# EAGLE design DomoMod (EAGLE 6.5.0)
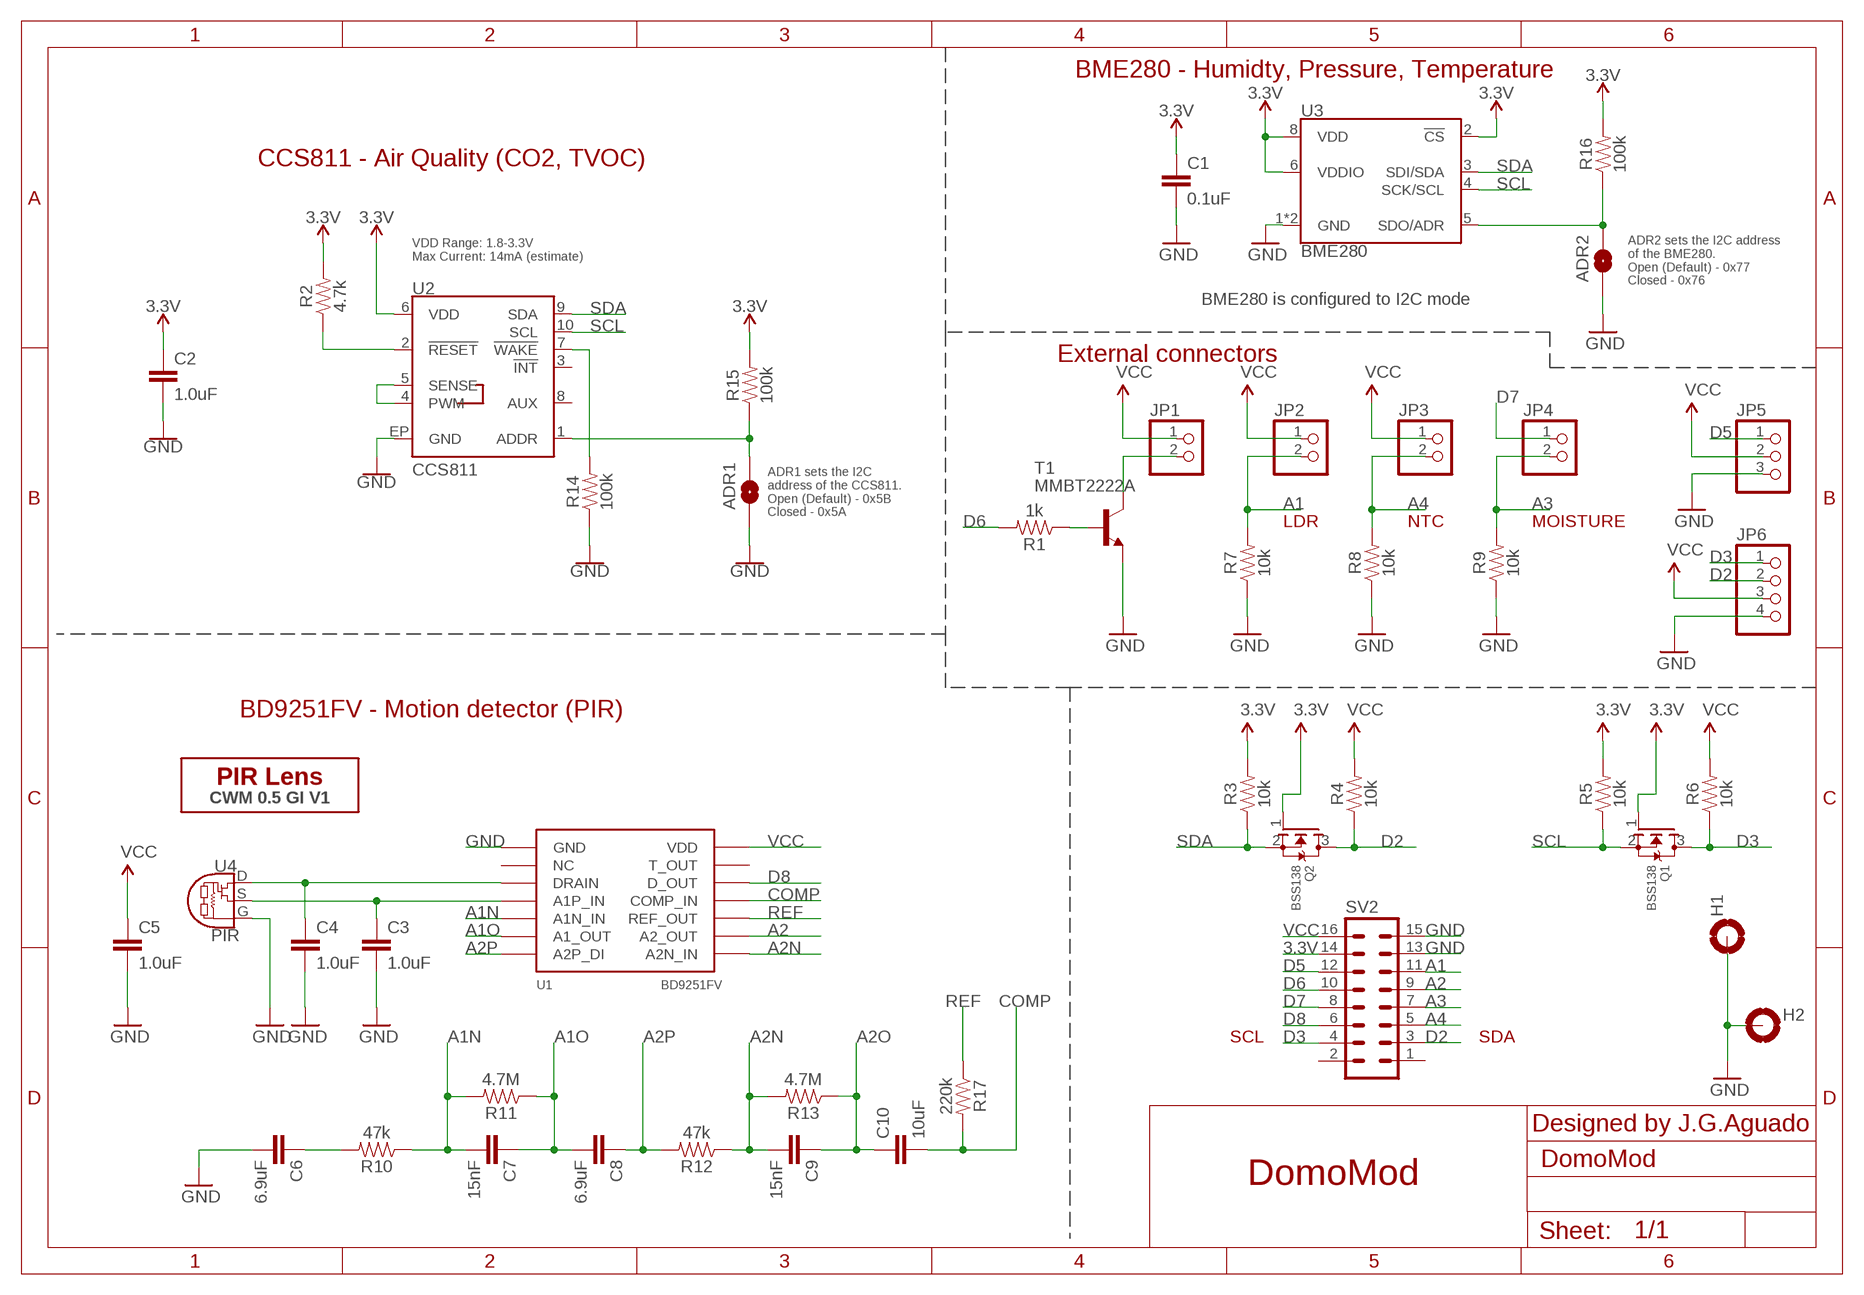
[diagram p0: schematic, sheet 1]

## Parts
ADR1  JUMPER-SMT_2_NO_SILK  [SMT-JUMPER_2_NO_SILK]
ADR2  JUMPER-SMT_2_NO_SILK  [SMT-JUMPER_2_NO_SILK]
C1  0.1uF  0.1UF-0603-25V-(+80/-20%)  [0603]
C2  1.0uF  1.0UF-0603-16V-10%  [0603]
C3  1.0uF  1.0UF-0603-16V-10%  [0603]
C4  1.0uF  1.0UF-0603-16V-10%  [0603]
C5  1.0uF  1.0UF-0603-16V-10%  [0603]
C6  6.9uF  1.0UF-0603-16V-10%  [0603]
C7  15nF  1.0UF-0603-16V-10%  [0603]
C8  6.9uF  1.0UF-0603-16V-10%  [0603]
C9  15nF  1.0UF-0603-16V-10%  [0603]
C10  10uF  1.0UF-0603-16V-10%  [0603]
H1  MOUNT-PAD-ROUND3.2  [3,2-PAD]
H2  MOUNT-PAD-ROUND3.2  [3,2-PAD]
JP1  PINHD-1X2  [1X02]
JP2  PINHD-1X2  [1X02]
JP3  PINHD-1X2  [1X02]
JP4  PINHD-1X2  [1X02]
JP5  PINHD-1X3  [1X03]
JP6  PINHD-1X4  [1X04]
Q1  BSS138  MOSFET-NREFLOW  [SOT23]
Q2  BSS138  MOSFET-NREFLOW  [SOT23]
R1  1k  100KOHM-0603-1/10W-1%  [0603]
R2  4.7k  4.7KOHM-0603-1/10W-1%  [0603]
R3  10k  100KOHM-0603-1/10W-1%  [0603]
R4  10k  100KOHM-0603-1/10W-1%  [0603]
R5  10k  100KOHM-0603-1/10W-1%  [0603]
R6  10k  100KOHM-0603-1/10W-1%  [0603]
R7  10k  100KOHM-0603-1/10W-1%  [0603]
R8  10k  100KOHM-0603-1/10W-1%  [0603]
R9  10k  100KOHM-0603-1/10W-1%  [0603]
R10  47k  100KOHM-0603-1/10W-1%  [0603]
R11  4.7M  100KOHM-0603-1/10W-1%  [0603]
R12  47k  100KOHM-0603-1/10W-1%  [0603]
R13  4.7M  100KOHM-0603-1/10W-1%  [0603]
R14  100k  100KOHM-0603-1/10W-1%  [0603]
R15  100k  100KOHM-0603-1/10W-1%  [0603]
R16  100k  100KOHM-0603-1/10W-1%  [0603]
R17  220k  100KOHM-0603-1/10W-1%  [0603]
SV2  MA08-2  [MA08-2]
T1  MMBT2222A  BC808-NPN-SOT23-BEC  [SOT23-BEC]
U1  BD9251FV  [TSSOP-14]
U2  CCS811  CCS811PRODUCTION  [LGA10]
U3  BME280  [LGA-8-2.5X2.5]
U4  PIR  [PIR]
U$1  CWM 0.5 GI V1  PIR-LENSCWM-0.5-GI-V1  [LENS-CWM-0.5-GI-V1]

## Nets
3.3V: C1.1 C2.1 Q1.1(G) Q2.1(G) R2.2 R3.2 R5.2 R15.2 R16.2 SV2.14 U2.6(VDD) U3.2(!CS) U3.6(VDDIO) U3.8(VDD)
!RST: R2.1 U2.2(!RESET!)
!WAKE: R14.2 U2.7(!WAKE!)
A1: JP2.2 R7.2 SV2.11
A1N: C7.2 R10.1 R11.2 U1.5(A1N_IN)
A1O: C7.1 C8.2 R11.1 U1.6(A1_OUT)
A2: SV2.9 U1.9(A2_OUT)
A2N: C9.2 R12.1 R13.2 U1.8(A2N_IN)
A2O: C9.1 C10.1 R13.1
A2P: C8.1 R12.2 U1.7(A2P_DI)
A3: JP4.2 R9.2 SV2.7
A4: JP3.2 R8.2 SV2.5
CCS811_ADDR: ADR1.2 R15.1 U2.1(ADDR)
COMP: C10.2 R17.2 U1.11(COMP_IN)
D2: JP6.2 Q2.3(D) R4.1 SV2.3
D3: JP6.1 Q1.3(D) R6.1 SV2.4
D5: JP5.1 SV2.12
D6: R1.2 SV2.10
D7: JP4.1 SV2.8
D8: SV2.6 U1.12(D_OUT)
GND: ADR1.1 ADR2.1 C1.2 C2.2 C3.2 C4.2 C5.2 C6.2 H1.B3,2(MOUNT) H2.B3,2(MOUNT) JP5.3 JP6.4 R7.1 R8.1 R9.1 R14.1 SV2.13 SV2.15 T1.E U1.1(GND) U2.EP(GND) U3.1(GND) U3.7(GND) U4.G
N$1: C6.1 R10.2
N$2: C3.1 U1.4(A1P_IN) U4.S
N$5: C4.1 U1.3(DRAIN) U4.D
N$9: JP1.2 T1.C
N$10: R1.1 T1.B
NTC_SENSE: U2.4(PWM) U2.5(SENSE)
REF: R17.1 U1.10(REF_OUT)
SCL: Q1.2(S) R5.1 U2.10(SCL) U3.4(SCK/SCL)
SDA: Q2.2(S) R3.1 U2.9(SDA) U3.3(SDI/SDA)
SDO/ADR: ADR2.2 R16.1 U3.5(SDO/ADR)
VCC: C5.1 JP1.1 JP2.1 JP3.1 JP5.2 JP6.3 R4.2 R6.2 SV2.16 U1.14(VDD)
Unconnected: SV2.1 SV2.2 U1.2(NC) U1.13(T_OUT) U2.3(!INT!) U2.8(AUX)

## Notes on the sheet
- BME280 - Humidty, Pressure, Temperature
- CCS811 - Air Quality (CO2, TVOC)
- ADR2 sets the I2C address
  of the BME280.
  Open (Default) - 0x77
  Closed - 0x76
- VDD Range: 1.8-3.3V
  Max Current: 14mA (estimate)
- BME280 is configured to I2C mode
- External connectors
- Humidity
- ADR1 sets the I2C 
  address of the CCS811.
  Open (Default) - 0x5B
  Closed - 0x5A
- LDR | NTC | MOISTURE
- BD9251FV - Motion detector (PIR) | Pressure
- SCL | SDA
- Designed by J.G.Aguado
- DomoMod

## Library data of the parts
ADR1 ADR2 = SparkFun-Jumpers:JUMPER-SMT_2_NO: Normally open jumper This jumper has two pads in close proximity to each other. Apply solder to close the connection. Round pads are easier to solder for beginners, but are a lot larger. SparkFun Product that uses the round pads: SparkFun EL Sequencer <https://www.sparkfun.com/products/12781>
C1 = SparkFun-Capacitors:0.1UF: 0.1µF ceramic capacitors A capacitor is a passive two-terminal electrical component used to store electrical energy temporarily in an electric field.; PROD_ID: CAP-00810
C2-C5 = SparkFun-Capacitors:1.0UF: 1µF ceramic capacitors A capacitor is a passive two-terminal electrical component used to store electrical energy temporarily in an electric field.; PROD_ID: CAP-00868
C6-C10 = SparkFun-Capacitors:1.0UF: 1µF ceramic capacitors A capacitor is a passive two-terminal electrical component used to store electrical energy temporarily in an electric field.; PROD_ID: CAP-00868; VALUE: 1.0uF
H1 H2 = holes:MOUNT-PAD-ROUND: MOUNTING PAD, round
JP1-JP4 = pinhead:PINHD-1X2: PIN HEADER
JP5 = pinhead:PINHD-1X3: PIN HEADER
JP6 = pinhead:PINHD-1X4: PIN HEADER
Q1 Q2 = adafruit:MOSFET-N: N-Channel Mosfet 2N7002E - 60V 260mA SOT23 [Digikey: 2N7002ET1GOSTR-ND] - REEL BSH103 - 30V 850mA SOT23 [Digikey: 568-5013-1-ND]
R1 R3-R13 R17 = SparkFun-Resistors:100KOHM: 100kΩ resistor A resistor is a passive two-terminal electrical component that implements electrical resistance as a circuit element. Resistors act to reduce current flow, and, at the same time, act to lower voltage levels within circuits. - Wikipedia; PROD_ID: RES-07828; VALUE: 100k
R2 = SparkFun-Resistors:4.7KOHM: 4.7kΩ resistor A resistor is a passive two-terminal electrical component that implements electrical resistance as a circuit element. Resistors act to reduce current flow, and, at the same time, act to lower voltage levels within circuits. - Wikipedia; PROD_ID: RES-07857
R14-R16 = SparkFun-Resistors:100KOHM: 100kΩ resistor A resistor is a passive two-terminal electrical component that implements electrical resistance as a circuit element. Resistors act to reduce current flow, and, at the same time, act to lower voltage levels within circuits. - Wikipedia; PROD_ID: RES-07828
SV2 = con-lstb:MA08-2: PIN HEADER; OC_FARNELL: unknown; OC_NEWARK: unknown
T1 = transistor:*-NPN-: NPN Transistror BF959 corrected 2008.03.06
U1 = SpaceDIY_IC:BD9251FV: Amplifier for Pyroelectric Infrared Sensor
U2 = SparkFun-Sensors:CCS811: AMS CCS811 – I2C Digital Gas Sensor Ultra-Low Power Digital Gas Sensor for Monitoring Indoor Air Quality AMS Product Page <http://ams.com/eng/Products/Environmental-Sensors/Gas-Sensors/CCS811> SparkFun Products:; PROD_ID: IC-13607
U3 = SparkFun-Sensors:BME280: Bosch BME280 – Combined Humidity and Pressure Sensor The BME280 is as combined digital humidity, pressure and temperature sensor based on proven sensing principles. The sensor module is housed in an extremely compact metal-lid LGA package with a footprint of only 2.5×2.5mm² with a height of 0.93mm. Its small dimensions and its low power consumption allow the implementation in battery driven devices such as handsets, GPS modules or watches. Datasheet <https://cdn.sparkfun.com/assets/learn_tutorials/4/1/9/BST-BME280_DS001-10.pdf> SparkFun Products SparkFun Atmospheric Sensor Breakout - BME280 <https://www.sparkfun.com/products/13676> (SEN-13676); PROD_ID: IC-13090
U4 = openPIR-temp:PIR; PROD_ID: IC-13430
U$1 = openPIR-temp:PIR-LENS

## Net classes
1 vcc: width 0.254 mm

## Board
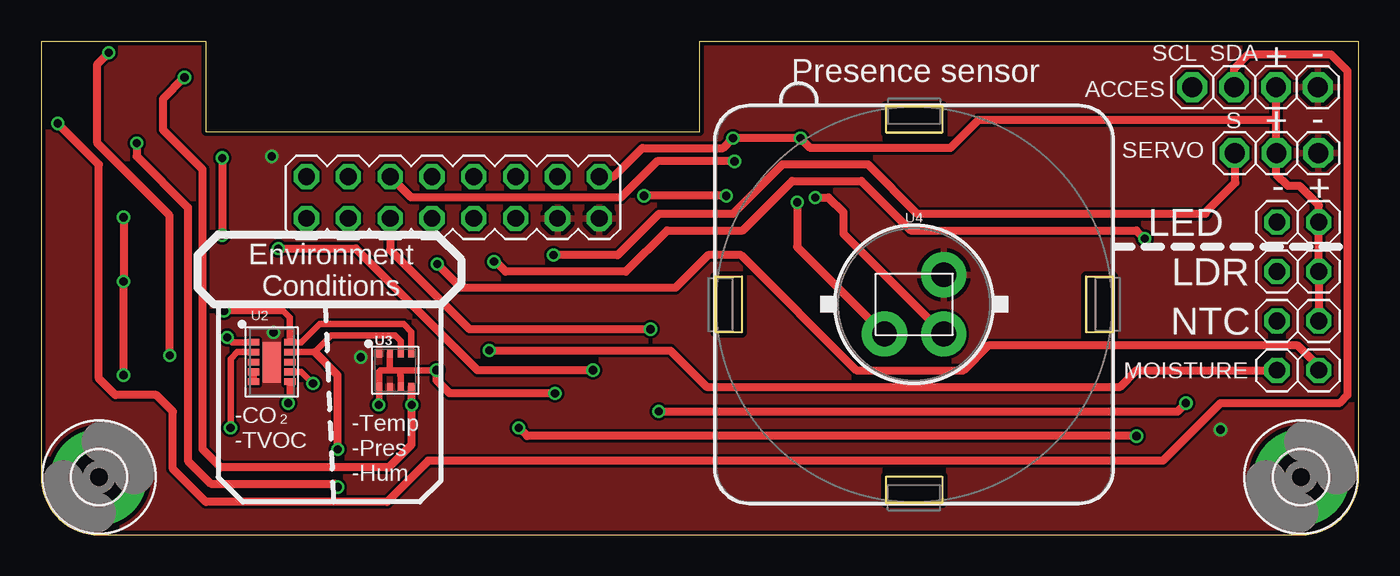
[diagram p1: board, top side]
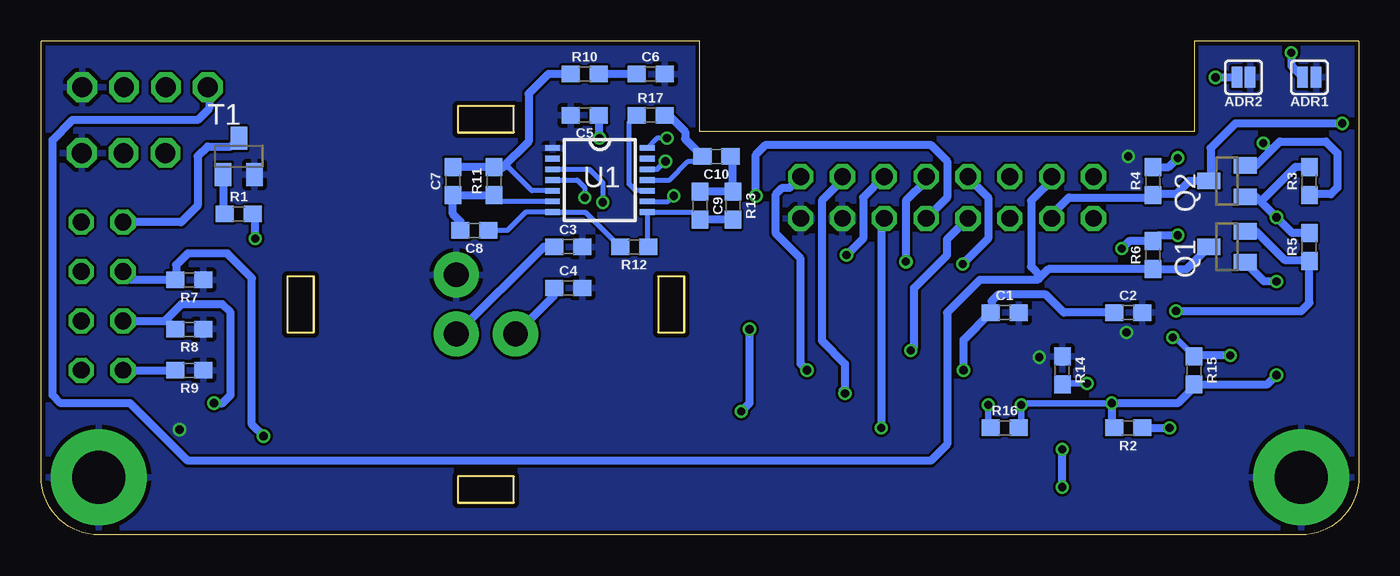
[diagram p2: board, bottom side, seen from below]

Size 80 x 30 mm. Coordinates in mm from the lower left corner, seen from the top.
Outline: 0,30 0,3.5 arc90 3.5,0 76.5,0 arc90 80,3.5 80,30 40,30 40,24.5 10,24.5 10,30 0,30
Copper layers (1*16): Top 0.035mm / dielectric 1.5mm / Bottom 0.035mm
Design rules "SeeedStudio_2layer_DRU_no_angle_20140221": minimum track width 6mil, minimum drill 12mil, track to track 6mil, track to pad 6mil, pad to pad 6mil, via to via 6mil, smd to smd 0mil, copper to edge 10mil, drill to drill 10mil, minimum pad ring 10mil, minimum via ring 6mil, stop-mask expansion 2mil, vias tented up to drill 100mil, thermal gap 10mil

### Footprints (pad centres in the part's own frame; a part is rotated, then mirrored left to right if it is on the bottom)
SMT-JUMPER_2_NO_SILK = smd 0.635 x 1.27: 1 -0.406,0; 2 0.406,0
0603 = smd 1.1 x 1: 1 -0.85,0; 2 0.85,0
3,2-PAD = drill 3.2 pad 5.842: B3,2 0,0
1X02 = drill 1.016 octagon: 1 -1.27,0; 2 1.27,0
1X03 = drill 1.2 octagon: 1 -2.54,0; 2 0,0; 3 2.54,0
1X04 = drill 1.2 octagon: 1 -3.81,0; 2 -1.27,0; 3 1.27,0; 4 3.81,0
SOT23 = smd 1 x 1.4: 1 -0.95,-1.1; 2 0.95,-1.1; 3 0,1.1
MA08-2 = drill 1.016 octagon: 1 -8.89,-1.27; 2 -8.89,1.27; 3 -6.35,-1.27; 4 -6.35,1.27; 5 -3.81,-1.27; 6 -3.81,1.27; 7 -1.27,-1.27; 8 -1.27,1.27; 9 1.27,-1.27; 10 1.27,1.27; 11 3.81,-1.27; 12 3.81,1.27; 13 6.35,-1.27; 14 6.35,1.27; 15 8.89,-1.27; 16 8.89,1.27
SOT23-BEC = smd 1 x 1.4: B -0.95,-1.1; C 0,1.1; E 0.95,-1.1
TSSOP-14 = smd 0.9 x 0.35: 1 -2.955,2.01; 2 -2.955,1.36; 3 -2.955,0.71; 4 -2.955,0.06; 5 -2.955,-0.59; 6 -2.955,-1.24; 7 -2.955,-1.89; 8 2.795,-1.89; 9 2.795,-1.24; 10 2.795,-0.59; 11 2.795,0.06; 12 2.795,0.71; 13 2.795,1.36; 14 2.795,2.01
LGA10 = smd 0.7 x 0.4: 1 -1.1,1.2; 2 -1.1,0.6; 3 -1.1,0; 4 -1.1,-0.6; 5 -1.1,-1.2; 6 1.1,-1.2; 7 1.1,-0.6; 8 1.1,0; 9 1.1,0.6; 10 1.1,1.2 | smd 1.1 x 2.45: EP 0,0
LGA-8-2.5X2.5 = smd 0.35 x 0.5: 1 -0.975,1.025; 2 -0.325,1.025; 3 0.325,1.025; 4 0.975,1.025; 5 0.975,-1.025; 6 0.325,-1.025; 7 -0.325,-1.025; 8 -0.975,-1.025
PIR = drill 1.5 pad 2.75: D -1.8,-1.8; G 1.8,1.8; S 1.8,-1.8

### Placement (x,y rotation side)
ADR1  3,27.8 180 bottom
ADR2  7,27.8 180 bottom
C1  21.5,13.5 0 bottom
C2  14,13.5 0 bottom
C3  48,17.5 0 bottom
C4  48,15 0 bottom
C5  47,25.5 180 bottom
C6  43,28 0 bottom
C7  55,21.5 90 bottom
C8  53.7,18.5 180 bottom
C9  40,20 270 bottom
C10  39,23 180 bottom
H1  3.5,3.5 0 top
H2  76.5,3.5 0 top
JP1  76.3,19 180 top
JP2  76.3,16 180 top
JP3  76.3,13 180 top
JP4  76.3,10 180 top
JP5  75,23.2 0 top
JP6  73.7,27.2 0 top
Q1  8,17.5 90 bottom
Q2  8,21.5 90 bottom
R1  68,19.5 0 bottom
R2  14,6.5 180 bottom
R3  3,21.5 90 bottom
R4  12.5,21.5 90 bottom
R5  3,17.5 90 bottom
R6  12.5,17 90 bottom
R7  71,15.5 180 bottom
R8  71,12.5 180 bottom
R9  71,10 180 bottom
R10  47,28 0 bottom
R11  52.5,21.5 90 bottom
R12  44,17.5 180 bottom
R13  38,20 270 bottom
R14  18,10 270 bottom
R15  10,10 270 bottom
R16  21.5,6.5 0 bottom
R17  43,25.5 0 bottom
SV2  25,20.5 0 top
T1  68,23 0 bottom
U1  46,21.5 0 bottom
U2  14,10.5 0 top
U3  21.5,10 0 top
U4  53,14 0 top
U$1  53,14 0 top

### Tracks (layer width: path | path; a pad name or v marks a point on that pad's centre or on a via)
3.3V  (via drill 0.5)
  Top 0.4: U2.6 15.1,8.1 v15,8 | U3.2 21.18,10.07 | 21.18,10.07 21.1,10 | 21.1,10 20.6,10 20.52,9.93 U3.8 20.52,7.92 v20.5,7.9 | U3.6 21.82,9.68 21.8,9.7 21.8,9.9 21.7,10 21.25,10 21.18,10.07 | v24,10 21.1,10
  Top 0.5: v5,19.3 v5,15.4 v5,9.7 | v24,10 24,9.4 24.8,8.6 v31.2,8.6
  Bottom 0.4: R16.2 20.5,6.65 v20.5,7.9 20.4,8 v15,8
  Bottom 0.5: v24,10 24,11.85 C1.1 22.3,13.55 22.3,14.2 21.9,14.6 19,14.6 17.9,13.5 C2.1 | R2.2 15,6.65 v15,8 11,8 10,9 R15.2 5.55,9.15 v5,9.7 | Q2.1 6.25,20.55 5.95,20.25 | 5.95,20.25 v5,19.3 4.05,18.35 R5.2 | v5,15.4 5.75,15.4 Q1.1 | R3.2 3.85,22.35 5.95,20.25 | 31.35,8.75 v31.2,8.6 31.2,10.4 32.6,11.8 32.6,20.3 31.35,21.55 SV2.14
!RST  (via drill 0.5)
  Top 0.4: U2.2 11.9,11.1 11.5,10.7 v11.5,6.5
  Bottom 0.5: R2.1 v11.5,6.5
!WAKE  (via drill 0.5)
  Top 0.4: U2.7 15.8,9.9 v16.5,9.2
  Bottom 0.4: v16.5,9.2 17.95,9.2 R14.2
A1  (via drill 0.5)
  Top 0.5: v66.5,6 29.5,6 v29,6.5
  Bottom 0.5: v29,6.5 29,19.04 SV2.11 | JP2.2 74.53,15.5 R7.2 71.8,15.55 71.8,16.4 71.1,17.1 68.7,17.1 67.2,15.6 67.2,6.7 v66.5,6
A1N
  Bottom 0.3: U1.5 50.21,20.91 51.6,22.3 52,22.3 52.45,22.3 R11.2
  Bottom 0.5: R11.2 C7.2 | R10.1 49.2,28 50.4,26.8 50.4,23.9 52,22.3
A1O
  Bottom 0.3: U1.6 52.11,20.26 R11.1
  Bottom 0.5: C8.2 54.55,19.05 55,19.5 C7.1 R11.1
A2  (via drill 0.5)
  Top 0.5: v41.6,20.6 v36.6,20.6
  Bottom 0.3: U1.9 41.94,20.26 v41.6,20.6
  Bottom 0.5: v36.6,20.6 36.6,23.1 36,23.7 26,23.7 25,22.7 25,20.5 SV2.9
A2N
  Bottom 0.3: C9.2 40.46,19.61 U1.8 43.2,17.55 R12.1
  Bottom 0.5: R13.2 C9.2
A2O
  Bottom 0.5: C10.1 38,22.85 R13.1 C9.1
A2P
  Bottom 0.3: R12.2 46.96,19.61 U1.7 50.59,19.61 51.7,18.5 C8.1
A3  (via drill 0.5)
  Top 0.5: JP4.2 66.5,10 65.5,9 40.4,9 38.2,11.2 v27.2,11.2
  Bottom 0.5: JP4.2 R9.2 | v27.2,11.2 27,11.4 27,15 25,17 25,17.96 SV2.7
A4  (via drill 0.5)
  Top 0.5: v37,12.5 26,12.5 21.19,17.31 SV2.5 | v37.5,7.5 69,7.5 v69.5,8
  Bottom 0.5: JP3.2 72.5,13 | 72.5,13 72.35,13 R8.2 | v37,12.5 37,8 v37.5,7.5 | v69.5,8 69,8 68.5,8.5 68.5,13.5 69,14 71.5,14 72.5,13
CCS811_ADDR  (via drill 0.5)
  Top 0.4: U2.1 11.6,11.7 v11.3,12
  Top 0.5: v7.8,10.9 7.8,19.4 3.41,23.79 3.41,28.61 v4.1,29.3
  Bottom 0.4: v11.3,12 11.15,12 R15.1
  Bottom 0.5: v7.8,10.9 9.95,10.9 R15.1 | v4.1,29.3 4.1,28.49 ADR1.2
COMP
  Bottom 0.3: U1.11 41.84,21.56 40.7,22.7 40.15,22.7 C10.2
  Bottom 0.5: R17.2 41.9,25.5 40.9,24.5 40.9,24.05 C10.2
D2  (via drill 0.5)
  Top 0.5: JP6.2 72.43,28.33 73.3,29.2 78.3,29.2 79.3,28.2 79.3,8.5 78.8,8 71.6,8 68.1,4.5 23.5,4.5 21,2 10,2 8,4 8,7.5 7,8.5 4.5,8.5 3.5,9.5 3.5,22.5 v1,25
  Bottom 0.5: v1,25 7.5,25 9,23.5 9,21.6 Q2.3 10.3,21.5 11.1,20.7 12.45,20.7 R4.1 12.65,20.5 17.6,20.5 18.65,19.45 SV2.3
D3
  Bottom 0.5: Q1.3 10.45,16.15 R6.1 18.85,16.15 19.3,15.7 | JP6.1 69.8,27.11 69.8,25.9 70.5,25.2 78.1,25.2 79.3,24 79.3,8.5 78.8,8 74.6,8 71.1,4.5 26,4.5 25,5.5 25,13.5 23,15.5 19.5,15.5 19.3,15.7 | SV2.4 18.65,21.55 19.9,20.3 19.9,16.3 19.3,15.7
D5  (via drill 0.5)
  Top 0.5: v31.1,17 35,17 37.5,19.5 42,19.5 45,22.5 50.2,22.5 53.2,19.5 70.7,19.5 70.7,19.6 72.5,21.4 72.5,23.16 JP5.1 72.4,23.14
  Bottom 0.5: SV2.12 28.83,21.77 30.1,20.5 30.1,18 v31.1,17
D6  (via drill 0.5)
  Top 0.5: v67,18 66.5,18.5 52.8,18.5 49.8,21.5 45.6,21.5 42.6,18.5 38,18.5 35.5,16 28.2,16 27.6,16.6 v27.5,16.6
  Bottom 0.5: v67,18 67,19.35 R1.2 | SV2.10 26.27,21.53 27.5,20.3 v27.5,16.6
D7  (via drill 0.5)
  Top 0.5: 24,16.5 v24.05,16.45 25.5,15 38.5,15 40.5,17 42.5,17 49.5,10 56,10 57.5,11.5 76.3,11.5 77.57,10.23 JP4.1
  Bottom 0.5: SV2.8 23.73,21.73 22.5,20.5 22.5,18 v24.05,16.45
D8  (via drill 0.5)
  Top 0.5: v42.1,22.7 37.4,22.7 35.2,20.5 22.46,20.5 SV2.6
  Bottom 0.3: U1.12 42.59,22.21 v42.1,22.7
GND  (via drill 0.5)
  other vias: 19.4,10.8 14.1,12.3 14,23 71.6,6.4
  pour Top: 80,30 80,3.5 arc-90 76.5,0 3.5,0 arc-90 0,3.5 0,30 10,30 10,24.5 40,24.5 40,30
  pour Bottom: 80,30 80,3.5 arc-90 76.5,0 3.5,0 arc-90 0,3.5 0,30 10,30 10,24.5 40,24.5 40,30
N$1
  Bottom 0.5: C6.1 R10.2
N$2  (via drill 0.5)
  Top 0.5: v47,20.5 47.8,20.5 48.7,19.6 48.7,18.3 U4.S
  Bottom 0.3: U1.4 47.46,21.56 47,21.1 v47,20.5
  Bottom 0.5: C3.1 49.5,17.5 U4.S
N$5  (via drill 0.5)
  Top 0.5: v45.9,20.2 45.9,17.5 U4.D
  Bottom 0.3: U1.3 46.71,22.21 45.9,21.4 v45.9,20.2
  Bottom 0.5: C4.1 48.85,14.55 U4.D
N$9
  Bottom 0.5: JP1.2 71.5,19 70.5,20 70.5,23 69.9,23.6 68.5,23.6 T1.C
N$10
  Bottom 0.5: T1.B 68.95,19.6 R1.1
NTC_SENSE
  Top 0.4: U2.5 U2.4
REF
  Bottom 0.3: U1.10 43.91,20.91 44.3,21.3 44.3,25.05 R17.1
SCL  (via drill 0.5)
  Top 0.4: U3.4 22.48,12.32 22,12.8 16.9,12.8 15.8,11.7 U2.10 15.1,13.2 14.7,13.6 v11.1,13.6
  Bottom 0.5: v11.1,13.6 3.5,13.6 3,14.1 R5.1 3.05,16.7 4.5,16.7 6.25,18.45 Q1.2
SDA  (via drill 0.5)
  Top 0.4: U3.3 21.82,11.78 21.5,12.1 17.6,12.1 16.6,11.1 U2.9
  Top 0.5: v5.8,23.8 5.8,23 8.9,19.9 8.9,4.5 10.3,3.1 17.8,3.1 v18,2.9 | v18,5.2 18,9.7 16.6,11.1
  Bottom 0.5: 5.3,23.4 4.8,23.9 2,23.9 1.3,23.2 1.3,21.1 1.7,20.7 2.95,20.7 R3.1 | Q2.2 6.25,22.45 5.3,23.4 | 5.3,23.4 5.4,23.4 v5.8,23.8 | v18,2.9 v18,5.2
SDO/ADR  (via drill 0.5)
  Top 0.4: U3.5 22.48,7.92 v22.5,7.9
  Top 0.5: U3.5 22.48,5.47 21.1,4.1 10.9,4.1 9.8,5.2 9.8,22.2 7.4,24.6 7.4,26.5 v8.7,27.8
  Bottom 0.4: v22.5,7.9 22.5,6.65 R16.1
  Bottom 0.5: v8.7,27.8 ADR2.2
VCC  (via drill 0.5)
  Top 0.5: v11,22.9 v11,18.2 | v14.4,17.4 19.1,17.4 26.5,10 v33.5,10 | JP3.1 JP2.1 JP1.1 77.57,20.03 76.4,21.2 75.7,21.2 75,21.9 JP5.2 75,27.17 JP6.3 74.97,25.37 74.8,25.2 56.9,25.2 55.2,23.5 46.7,23.5 v46.1,24.1 v42,24.1 41.4,23.5 36.5,23.5 34.77,21.77 SV2.16
  Bottom 0.3: v42,24.1 42.62,24.1 U1.14
  Bottom 0.5: R4.2 11.55,22.35 v11,22.9 | v11,18.2 12.15,18.2 R6.2 13.95,17.85 v14.4,17.4 | v33.5,10 33.89,10.39 33.89,16.79 35.4,18.3 35.4,20.7 35,21.1 34.56,21.1 SV2.16 | C5.1 46.15,24.15 v46.1,24.1

### Text on the board
tNames: SCL | SDA | + | Presence sensor | - | ACCES | S | + | - | SERVO | + | - | LED | Environment / Conditions | LDR | NTC | MOISTURE | 2 | -CO / -TVOC | -Temp / -Pres / -Hum